# EAGLE design sd_tos_dip32 (EAGLE 6.2)
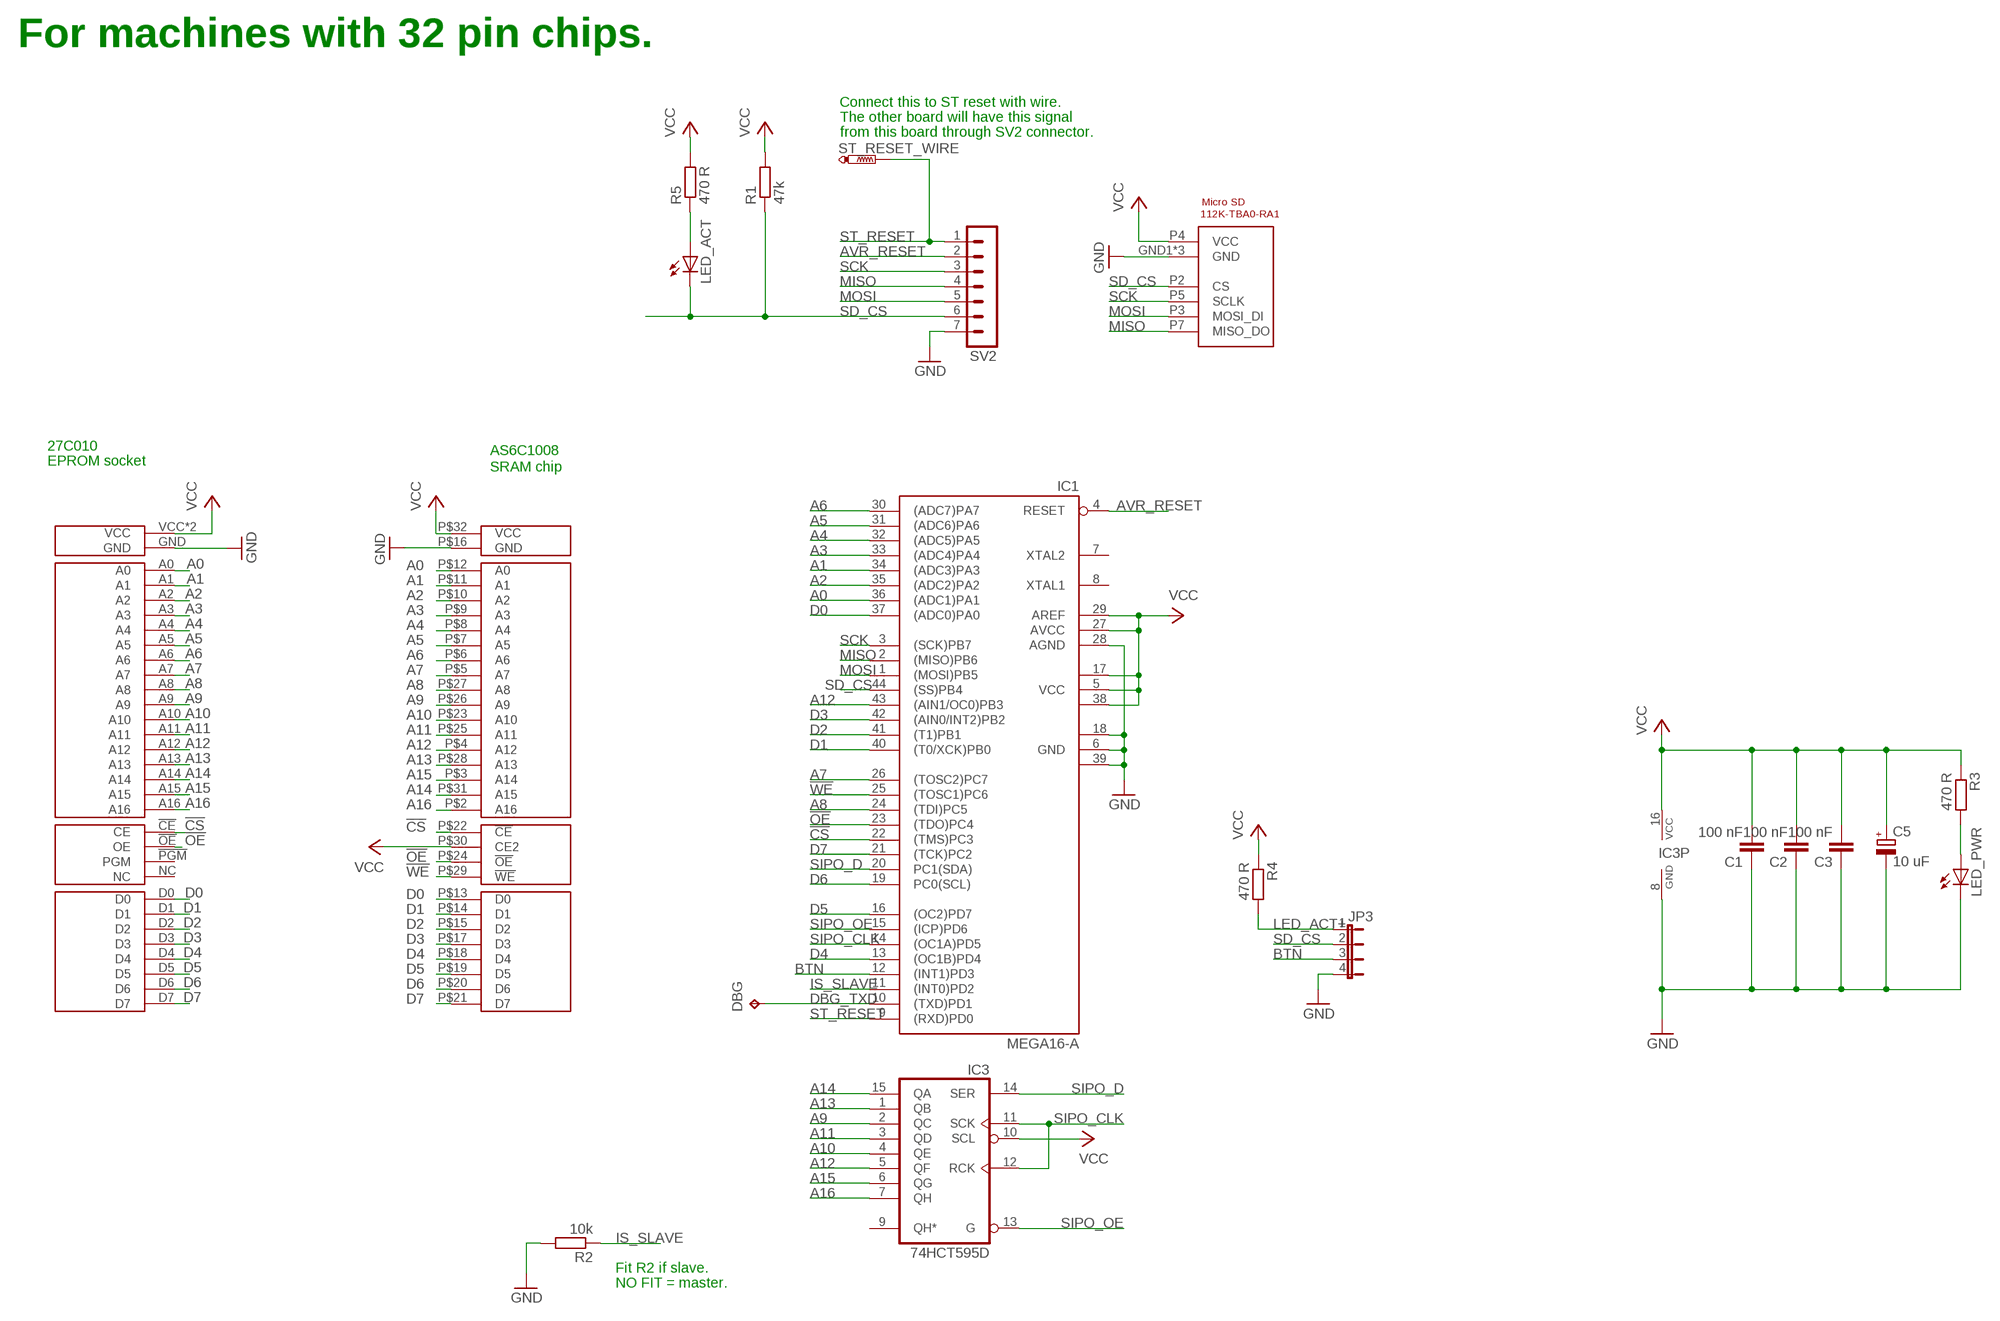
[diagram p0: schematic, sheet 1]

## Parts
C1  100 nF  C-EUC0603  [C0603]
C2  100 nF  C-EUC0603  [C0603]
C3  100 nF  C-EUC0603  [C0603]
C5  10 uF  CPOL-EUSANYO_SMD_B6  [SANYO-OSCON_SMD_B6]
DBG  TPB1,27  [B1,27]
IC1  MEGA16-A  [TQFP44]
IC3  74HCT595D  [SO16]
JP3  JP4E  [JP4]
LED_ACT  LEDCHIP-LED0805  [CHIP-LED0805]
LED_PWR  LEDCHIP-LED0805  [CHIP-LED0805]
R1  47k  R-EU_R0603  [R0603]
R2  10k  R-EU_R0603  [R0603]
R3  470 R  R-EU_R0603  [R0603]
R4  470 R  R-EU_R0603  [R0603]
R5  470 R  R-EU_R0603  [R0603]
ST_RESET_WIRE  PTR1PAD1-13  [P1-13]
SV2  MA07-1  [MA07-1]
U$1  27C010_BOTTOM_ONLY  [DIP32_BOTTOM_ONLY]
U$2  AS6C1008DIP32  [DIP32]
U$3  MICRO_SD  [MICRO_SD]

## Nets
!CS: IC1.22((TMS)PC3) U$1.!CE(CE) U$2.P$22(!CE)
!OE: IC1.23((TDO)PC4) U$1.!OE(OE) U$2.P$24(!OE)
!WE: IC1.25((TOSC1)PC6) U$2.P$29(!WE)
A0: IC1.36((ADC1)PA1) U$1.A0 U$2.P$12(A0)
A1: IC1.34((ADC3)PA3) U$1.A1 U$2.P$11(A1)
A2: IC1.35((ADC2)PA2) U$1.A2 U$2.P$10(A2)
A3: IC1.33((ADC4)PA4) U$1.A3 U$2.P$9(A3)
A4: IC1.32((ADC5)PA5) U$1.A4 U$2.P$8(A4)
A5: IC1.31((ADC6)PA6) U$1.A5 U$2.P$7(A5)
A6: IC1.30((ADC7)PA7) U$1.A6 U$2.P$6(A6)
A7: IC1.26((TOSC2)PC7) U$1.A7 U$2.P$5(A7)
A8: IC1.24((TDI)PC5) U$1.A8 U$2.P$27(A8)
A9: IC3.2(QC) U$1.A9 U$2.P$26(A9)
A10: IC3.4(QE) U$1.A10 U$2.P$23(A10)
A11: IC3.3(QD) U$1.A11 U$2.P$25(A11)
A12: IC1.43((AIN1/OC0)PB3) IC3.5(QF) U$1.A12 U$2.P$4(A12)
A13: IC3.1(QB) U$1.A13 U$2.P$28(A13)
A14: IC3.15(QA) U$1.A14 U$2.P$31(A15)
A15: IC3.6(QG) U$1.A15 U$2.P$3(A14)
A16: IC3.7(QH) U$1.A16 U$2.P$2(A16)
AVR_RESET: IC1.4(RESET) SV2.2
BTN: IC1.12((INT1)PD3) JP3.3
D0: IC1.37((ADC0)PA0) U$1.D0 U$2.P$13(D0)
D1: IC1.40((T0/XCK)PB0) U$1.D1 U$2.P$14(D1)
D2: IC1.41((T1)PB1) U$1.D2 U$2.P$15(D2)
D3: IC1.42((AIN0/INT2)PB2) U$1.D3 U$2.P$17(D3)
D4: IC1.13((OC1B)PD4) U$1.D4 U$2.P$18(D4)
D5: IC1.16((OC2)PD7) U$1.D5 U$2.P$19(D5)
D6: IC1.19(PC0(SCL)) U$1.D6 U$2.P$20(D6)
D7: IC1.21((TCK)PC2) U$1.D7 U$2.P$21(D7)
DBG_TXD: DBG.TP IC1.10((TXD)PD1)
GND: C1.1 C2.1 C3.1 C5.- IC1.6(GND) IC1.18(GND1) IC1.28(AGND) IC1.39(GND2) IC3.8(GND) JP3.4 LED_PWR.C R2.2 SV2.7 U$1.GND U$2.P$16(GND) U$3.GND1(GND) U$3.GND2(GND) U$3.P6(GND)
IS_SLAVE: IC1.11((INT0)PD2) R2.1
LED_ACT+: JP3.1 R4.2
MISO: IC1.2((MISO)PB6) SV2.4 U$3.P7(MISO_DO)
MOSI: IC1.1((MOSI)PB5) SV2.5 U$3.P3(MOSI_DI)
N$1: LED_PWR.A R3.2
N$2: LED_ACT.A R5.1
SCK: IC1.3((SCK)PB7) SV2.3 U$3.P5(SCLK)
SD_CS: IC1.44((SS)PB4) JP3.2 LED_ACT.C R1.1 SV2.6 U$3.P2(CS)
SIPO_CLK: IC1.14((OC1A)PD5) IC3.11(SCK) IC3.12(RCK)
SIPO_D: IC1.20(PC1(SDA)) IC3.14(SER)
SIPO_OE: IC1.15((ICP)PD6) IC3.13(G)
ST_RESET: IC1.9((RXD)PD0) ST_RESET_WIRE.TP SV2.1
VCC: C1.2 C2.2 C3.2 C5.+ IC1.5(VCC) IC1.17(VCC1) IC1.27(AVCC) IC1.29(AREF) IC1.38(VCC2) IC3.10(SCL) IC3.16(VCC) R1.2 R3.1 R4.1 R5.2 U$1.VCC U$1.VPP(VCC) U$2.P$30(CE2) U$2.P$32(VCC) U$3.P4(VCC)
Unconnected: IC1.7(XTAL2) IC1.8(XTAL1) IC3.9(QH*) U$1.!PGM(PGM) U$1.NC

## Notes on the sheet
- For machines with 32 pin chips.
- Connect this to ST reset with wire.
- The other board will have this signal
- from this board through SV2 connector.
- 27C010
- AS6C1008
- EPROM socket
- SRAM chip
- Fit R2 if slave.
- NO FIT = master.

## Library data of the parts
C1-C3 = rcl:C-EU: CAPACITOR, European symbol
C5 = rcl:CPOL-EU: POLARIZED CAPACITOR, European symbol
DBG = testpad:TP: Test pad
IC1 = avr-6:MEGA16: MICROCONTROLLER 16 Kbytes FLASH 1 kbytes SRAM 512 bytes EEPROM USART 8-channel 10 bit ADC
IC3 = 74xx-eu:74*595: 8-bit SHIFT REGISTER, output latch
JP3 = jumper:JP4E: JUMPER
LED_ACT LED_PWR = led:LED: LED OSRAM: - CHIPLED LG R971, LG N971, LY N971, LG Q971, LY Q971, LO R971, LY R971 LH N974, LH R974 LS Q976, LO Q976, LY Q976 LO Q996 - Hyper CHIPLED LW Q18S LB Q993, LB Q99A, LB R99A - SideLED LS A670, LO A670, LY A670, LG A670, LP A670 LB A673, LV A673, LT A673, LW A673 LH A674 LY A675 LS A676, LA A676, LO A676, LY A676, LW A676 LS A679, LY A679, LG A679 - Hyper Micro SIDELED® LS Y876, LA Y876, LO Y876, LY Y876 LT Y87S - SmartLED LW L88C, LW L88S LB L89C, LB L89S, LG L890 LS L89K, LO L89K, LY L89K LS L896, LA L896, LO L896, LY L896 - TOPLED LS T670, LO T670, LY T670, LG T670, LP T670 LSG T670, LSP T670, LSY T670, LOP T670, LYG T670 LG T671, LOG T671, LSG T671 LB T673, LV T673, LT T673, LW T673 LH T674 LS T676, LA T676, LO T676, LY T676, LB T676, LH T676, LSB T676, LW T676 LB T67C, LV T67C, LT T67C, LS T67K, LO T67K, LY T67K, LW E67C LS E67B, LA E67B, LO E67B, LY E67B, LB E67C, LV E67C, LT E67C LW T67C LS T679, LY T679, LG T679 LS T770, LO T770, LY T770, LG T770, LP T770 LB T773, LV T773, LT T773, LW T773 LH T774 LS E675, LA E675, LY E675, LS T675 LS T776, LA T776, LO T776, LY T776, LB T776 LHGB T686 LT T68C, LB T68C - Hyper Mini TOPLED® LB M676 - Mini TOPLED Santana® LG M470 LS M47K, LO M47K, LY M47K Source: http://www.osram.convergy.de LUXEON: - LUMILED® LXK2-PW12-R00, LXK2-PW12-S00, LXK2-PW14-U00, LXK2-PW14-V00 LXK2-PM12-R00, LXK2-PM12-S00, LXK2-PM14-U00 LXK2-PE12-Q00, LXK2-PE12-R00, LXK2-PE12-S00, LXK2-PE14-T00, LXK2-PE14-U00 LXK2-PB12-K00, LXK2-PB12-L00, LXK2-PB12-M00, LXK2-PB14-N00, LXK2-PB14-P00, LXK2-PB14-Q00 LXK2-PR12-L00, LXK2-PR12-M00, LXK2-PR14-Q00, LXK2-PR14-R00 LXK2-PD12-Q00, LXK2-PD12-R00, LXK2-PD12-S00 LXK2-PH12-R00, LXK2-PH12-S00 LXK2-PL12-P00, LXK2-PL12-Q00, LXK2-PL12-R00 Source: www.luxeon.com KINGBRIGHT: KA-3528ASYC Source: www.kingbright.com
R1-R5 = rcl:R-EU_: RESISTOR, European symbol
ST_RESET_WIRE = testpad:PTR1: TEST PIN
SV2 = con-lstb:MA07-1: PIN HEADER; OC_FARNELL: unknown; OC_NEWARK: unknown
U$1 = sd_tos:27C010_BOTTOM_ONLY
U$2 = sd_tos:AS6C1008
U$3 = sd_tos:MICRO_SD

## Board
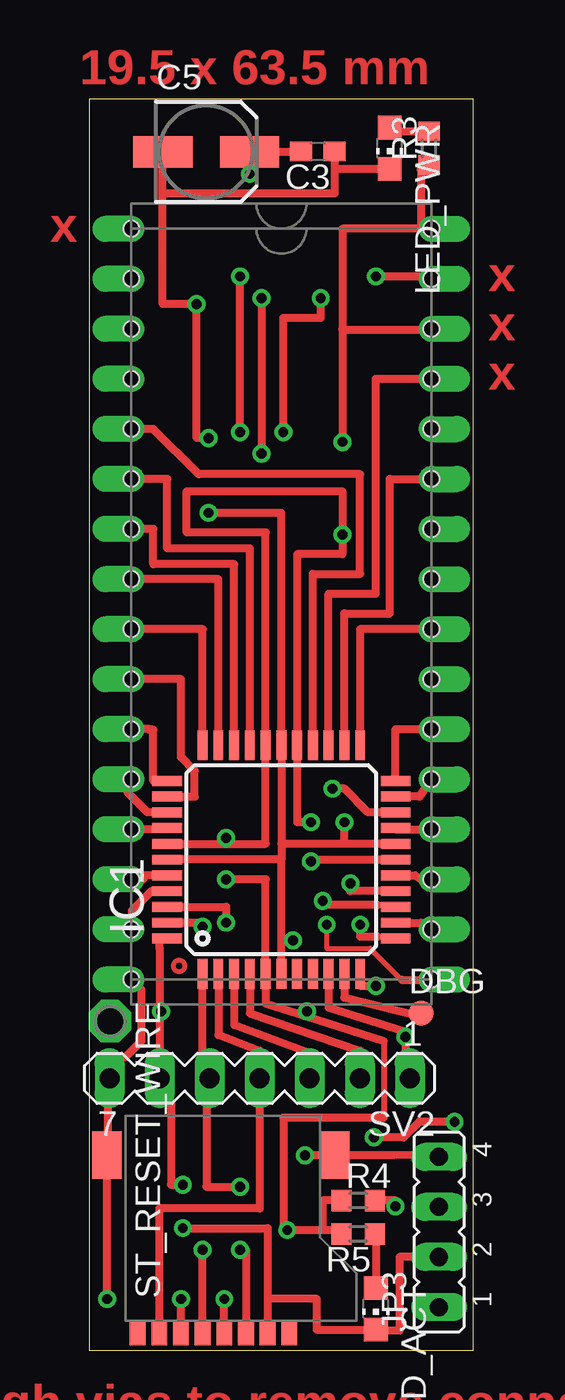
[diagram p1: board, top side]
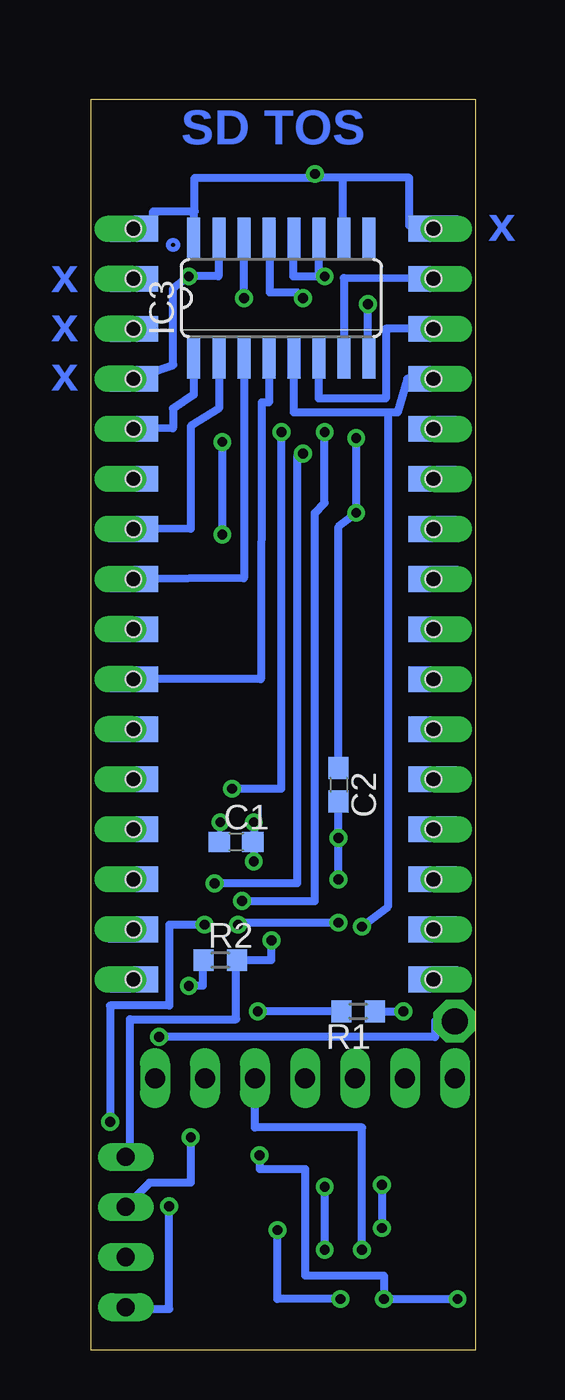
[diagram p2: board, bottom side, seen from below]

Size 19.5 x 63.5 mm. Coordinates in mm from the lower left corner, seen from the top.
Outline: 0,0 19.5,0 19.5,63.5 0,63.5 0,0
Copper layers (1*16): Top 0.035mm / dielectric 1.5mm / Bottom 0.035mm
Design rules: minimum track width 0.2mm, minimum drill 0.5mil, track to track 0.2mm, track to pad 0.2mm, pad to pad 0.2mm, via to via 0.2mm, smd to smd 0mil, copper to edge 0.1mm, drill to drill 0.1mm, minimum pad ring 10mil, minimum via ring 8mil, stop-mask expansion 4mil, vias tented up to drill 0mil, thermal gap 10mil

### Footprints (pad centres in the part's own frame; a part is rotated, then mirrored left to right if it is on the bottom)
C0603 = smd 1.1 x 1: 1 -0.85,0; 2 0.85,0
SANYO-OSCON_SMD_B6 = smd 3 x 1.6: + 2.2,0; - -2.2,0
B1,27 = smd 1.27 x 1.27: TP 0,0
TQFP44 = smd 1.5 x 0.5: 1 -5.8,4; 2 -5.8,3.2; 3 -5.8,2.4; 4 -5.8,1.6; 5 -5.8,0.8; 6 -5.8,0; 7 -5.8,-0.8; 8 -5.8,-1.6; 9 -5.8,-2.4; 10 -5.8,-3.2; 11 -5.8,-4; 23 5.8,-4; 24 5.8,-3.2; 25 5.8,-2.4; 26 5.8,-1.6; 27 5.8,-0.8; 28 5.8,0; 29 5.8,0.8; 30 5.8,1.6; 31 5.8,2.4; 32 5.8,3.2; 33 5.8,4 | smd 0.5 x 1.5: 12 -4,-5.8; 13 -3.2,-5.8; 14 -2.4,-5.8; 15 -1.6,-5.8; 16 -0.8,-5.8; 17 0,-5.8; 18 0.8,-5.8; 19 1.6,-5.8; 20 2.4,-5.8; 21 3.2,-5.8; 22 4,-5.8; 34 4,5.8; 35 3.2,5.8; 36 2.4,5.8; 37 1.6,5.8; 38 0.8,5.8; 39 0,5.8; 40 -0.8,5.8; 41 -1.6,5.8; 42 -2.4,5.8; 43 -3.2,5.8; 44 -4,5.8
SO16 = smd 0.66 x 2.032: 1 -4.445,-3.073; 2 -3.175,-3.073; 3 -1.905,-3.073; 4 -0.635,-3.073; 5 0.635,-3.073; 6 1.905,-3.073; 7 3.175,-3.073; 8 4.445,-3.073; 9 4.445,3.073; 10 3.175,3.073; 11 1.905,3.073; 12 0.635,3.073; 13 -0.635,3.073; 14 -1.905,3.073; 15 -3.175,3.073; 16 -4.445,3.073
JP4 = drill 0.914 long: 1 -3.81,0; 2 -1.27,0; 3 1.27,0; 4 3.81,0
CHIP-LED0805 = smd 1.2 x 1.2: A 0,-1.05; C 0,1.05
R0603 = smd 1 x 1.1: 1 -0.85,0; 2 0.85,0
P1-13 = drill 1.321 pad 2.159 octagon: TP 0,0
MA07-1 = drill 1.016 long: 1 -7.62,0; 2 -5.08,0; 3 -2.54,0; 4 0,0; 5 2.54,0; 6 5.08,0; 7 7.62,0
DIP32_BOTTOM_ONLY = smd 2.54 x 1.3 bottom: !CE 7.62,-5.08; !OE 7.62,0; !PGM 7.62,17.78; A0 -7.62,-7.62; A1 -7.62,-5.08; A2 -7.62,-2.54; A3 -7.62,0; A4 -7.62,2.54; A5 -7.62,5.08; A6 -7.62,7.62; A7 -7.62,10.16; A8 7.62,7.62; A9 7.62,5.08; A10 7.62,-2.54; A11 7.62,2.54; A12 -7.62,12.7; A13 7.62,10.16; A14 7.62,12.7; A15 -7.62,15.24; A16 -7.62,17.78; D0 -7.62,-10.16; D1 -7.62,-12.7; D2 -7.62,-15.24; D3 7.62,-17.78; D4 7.62,-15.24; D5 7.62,-12.7; D6 7.62,-10.16; D7 7.62,-7.62; GND -7.62,-17.78; NC 7.62,15.24; VCC 7.62,20.32; VPP -7.62,20.32 | hole 0.8: -7.62,20.32; -7.62,17.78; -7.62,15.24; -7.62,12.7; -7.62,10.16; -7.62,7.62; -7.62,5.08; -7.62,2.54; -7.62,0; -7.62,-2.54; -7.62,-5.08; -7.62,-7.62; -7.62,-10.16; -7.62,-12.7; -7.62,-15.24; -7.62,-17.78; 7.62,-17.78; 7.62,-15.24; 7.62,-12.7; 7.62,-10.16; 7.62,-7.62; 7.62,-5.08; 7.62,-2.54; 7.62,0; 7.62,2.54; 7.62,5.08; 7.62,7.62; 7.62,10.16; 7.62,12.7; 7.62,15.24; 7.62,17.78; 7.62,20.32
DIP32 = drill 0.8 pad 1.27 offset: P$1 -7.62,20.32; P$2 -7.62,17.78; P$3 -7.62,15.24; P$4 -7.62,12.7; P$5 -7.62,10.16; P$6 -7.62,7.62; P$7 -7.62,5.08; P$8 -7.62,2.54; P$9 -7.62,0; P$10 -7.62,-2.54; P$11 -7.62,-5.08; P$12 -7.62,-7.62; P$13 -7.62,-10.16; P$14 -7.62,-12.7; P$15 -7.62,-15.24; P$16 -7.62,-17.78; P$17 7.62,-17.78; P$18 7.62,-15.24; P$19 7.62,-12.7; P$20 7.62,-10.16; P$21 7.62,-7.62; P$22 7.62,-5.08; P$23 7.62,-2.54; P$24 7.62,0; P$25 7.62,2.54; P$26 7.62,5.08; P$27 7.62,7.62; P$28 7.62,10.16; P$29 7.62,12.7; P$30 7.62,15.24; P$31 7.62,17.78; P$32 7.62,20.32
MICRO_SD = smd 1.5 x 2.4: GND1 -5.952,9; GND2 5.617,9 | smd 0.8 x 1.3: P1 3.3,0; P2 2.2,0; P3 1.1,0; P4 0,0; P5 -1.1,0; P6 -2.2,0; P7 -3.3,0; P8 -4.4,0

### Placement (x,y rotation side)
C1  12.15,25.8 0 bottom
C2  6.95,28.7 270 bottom
C3  11.6,60.84 180 top
C5  5.93,60.82 0 top
DBG  16.85,17.1 0 top
IC1  9.75,24.9 90 top
IC3  9.85,53.4 0 bottom
JP3  17.75,6 90 top
LED_ACT  14.55,2.1 180 top
LED_PWR  15.25,61 180 top
R1  5.95,17.2 180 bottom
R2  12.95,19.8 0 bottom
R3  17.25,61 90 top
R4  13.65,7.6 0 top
R5  13.65,5.9 180 top
ST_RESET_WIRE  1.05,16.7 270 top
SV2  8.65,13.8 180 top
U$1  9.75,36.6 0 top
U$2  9.75,36.6 0 top
U$3  6.85,0.9 0 top

### Tracks (layer width: path | path; a pad name or v marks a point on that pad's centre or on a via)
!CS
  Top 0.406: IC1.22 15.55,31.52 U$2.P$22
!OE
  Top 0.406: U$2.P$24 13.75,36.6 IC1.23
!WE
  Top 0.406: IC1.25 12.15,38.4 14.55,38.4 14.55,49.3 U$2.P$29
A0
  Top 0.406: IC1.36 2.95,27.3 1.95,28.3 1.95,28.8 U$2.P$12
  Bottom 0.25: 2.08,29.08 U$2.P$12
A1
  Top 0.25: 3.05,31.5 3.05,31.52
  Top 0.406: IC1.34 3.25,28.9 3.25,31.5 3.05,31.5 | 3.05,31.52 U$2.P$11
  Bottom 0.25: 2.08,31.62 U$2.P$11
A2
  Top 0.406: IC1.35 5.35,28.1 5.35,29.4 4.65,30.1 4.65,34.06 U$2.P$10
A3
  Top 0.406: IC1.33 5.75,36.6 U$2.P$9
A4
  Top 0.406: IC1.32 6.55,39.14 U$2.P$8
A5
  Top 0.406: IC1.31 7.35,39.9 3.25,39.9 3.25,41.68 U$2.P$7
  Bottom 0.25: 2.08,41.78 U$2.P$7
A6
  Top 0.406: IC1.30 8.15,40.7 3.95,40.7 3.95,44.22 U$2.P$6
  Bottom 0.25: 2.08,44.32 U$2.P$6
A7
  Top 0.406: IC1.26 11.35,39.4 13.75,39.4 13.75,44.46 5.55,44.46 3.25,46.76 U$2.P$5
  Bottom 0.25: 2.08,46.86 U$2.P$5
A8
  Top 0.406: IC1.24 12.95,37.4 15.25,37.4 15.25,44.22 U$2.P$27
  Bottom 0.25: 17.32,44.32 U$2.P$27
A9
  Bottom 0.406: IC3.2 13.02,47.8 14.45,46.9 14.45,41.7 U$2.P$26
A10
  Bottom 0.406: IC3.4 10.48,48.1 10.85,48.1 10.88,34.06 U$2.P$23
A11
  Bottom 0.406: IC3.3 11.76,39.18 U$2.P$25
A12  (via drill 0.5 pad 0.8)
  Top 0.406: v5.75,21.5 5.75,21.7 IC1.43
  Bottom 0.406: U$2.P$4 3.45,49.3 3.95,47.6 4.45,47.6 | 4.45,47.6 9.22,47.6 IC3.5 | 4.45,47.6 4.45,22.5 v5.75,21.5
A13
  Bottom 0.25: 17.32,46.86 U$2.P$28
  Bottom 0.406: IC3.1 14.3,48.5 15.35,47.8 15.35,46.8 U$2.P$28
A14  (via drill 0.5 pad 0.8)
  Top 0.25: 17.37,54.5 U$2.P$31
  Top 0.406: v14.55,54.5 17.37,54.5
  Bottom 0.406: IC3.15 13.05,56.47 13.05,54.5 v14.55,54.5 15.34,53.9 15.34,50 U$1.A14
A15
  Bottom 0.406: U$2.P$3 4.55,51.84 4.55,48.3 7.95,48.3 IC3.6
A16
  Bottom 0.406: U$2.P$2 6.67,54.42 IC3.7
AVR_RESET
  Top 0.25: 13.75,15.2 SV2.2
  Top 0.406: IC1.4 8.15,17.1 13.75,15.2
BTN  (via drill 0.5 pad 0.8)
  Top 0.25: 15.85,20.8 15.55,20.8 IC1.12 15.15,20.9 14.65,21 | 15.85,20.8 15.85,20.9 16.05,20.9 | 15.85,20.8 16.15,20.8
  Top 0.406: v18.55,11.6 16.75,11.6 15.95,10.8 v14.45,10.8 | v13.75,21.6 13.75,21 14.65,21
  Bottom 0.406: v18.55,11.6 18.55,17.5 15.55,17.5 15.55,21.6 v13.75,21.6 | v14.45,10.8 14.45,8.5 16.55,8.5 JP3.3
D0
  Top 0.25: IC1.37 3.95,26.44
  Top 0.406: 3.95,26.44 U$2.P$13
D1
  Top 0.406: IC1.40 2.75,24.1 2.75,23.9 U$2.P$14
D2
  Top 0.25: 2.15,21.38 U$2.P$15
  Top 0.406: IC1.41 3.15,23.3 2.15,22.3 2.15,21.38
  Bottom 0.25: 2.08,21.46 U$2.P$15
D3  (via drill 0.5 pad 0.8)
  Top 0.25: v12.05,21.6 12.05,20.4 14.25,20.4 15.85,18.8 | 17.35,18.8 U$2.P$17
  Top 0.406: IC1.42 6.95,22.5 v6.95,21.7 | 15.85,18.8 17.35,18.8
  Bottom 0.25: 12.05,21.7 v12.05,21.6
  Bottom 0.406: v6.95,21.7 12.05,21.7
D4
  Top 0.406: IC1.13 16.85,21.7 17.25,21.36 U$2.P$18
  Bottom 0.25: 17.32,21.46 U$2.P$18
D5
  Top 0.406: IC1.16 16.55,24.1 16.85,23.9 U$2.P$19
D6
  Top 0.25: IC1.19 15.55,26.44
  Top 0.406: 15.55,26.44 U$2.P$20
  Bottom 0.25: 17.32,26.54 U$2.P$20
D7
  Top 0.406: U$2.P$21 16.77,28.1 IC1.21
  Bottom 0.25: 17.32,29.08 U$2.P$21
DBG_TXD
  Top 0.25: 16.65,17 16.65,17.1 DBG.TP
  Top 0.406: IC1.10 12.95,17.9 16.65,17
GND  (via drill 0.5 pad 0.8)
  Top 0.25: SV2.7 0.95,13.8 | JP3.4 17.75,9.91 | IC1.18 12.95,25.7
  Top 0.406: 0.95,13.8 U$3.GND1 v0.9,2.6 | U$3.P6 v4.65,2.6 | v10.95,9.9 U$3.GND2 15.45,9.9 17.75,9.91 | 9.75,25.7 IC1.28 9.75,42.5 v6.05,42.5 | 9.75,25.7 9.75,24.9 | 9.75,24.9 IC1.39 | IC1.18 9.75,25.7 | IC1.6 9.75,20.8 | 9.75,20.8 9.75,24.9 | C3.1 12.45,59.95 | 12.45,59.95 12.45,58.7 3.73,58.7 | 3.73,58.7 C5.- | 3.73,58.7 3.73,53.1 v5.45,53.1 5.45,46.3 v6.05,46.3 | v10.35,20.8 9.75,20.8 | SV2.7 1.03,14.48 1.45,14.9 1.85,14.9 2.65,15.7 2.65,18.3 U$2.P$16 | 12.95,25.7 v12.95,26.8 | LED_PWR.C 12.45,59.95
  Bottom 0.25: IC3.8 5.45,50.33 | v12.95,26.8 13,26.8 C1.1
  Bottom 0.406: v0.9,2.6 v4.65,2.6 4.65,3.8 8.65,3.8 8.65,9.2 10.95,9.2 v10.95,9.9 | JP3.4 17.55,9.81 17.55,16.8 12.15,16.8 12.15,19.8 R2.2 10.35,19.8 v10.35,20.8 | 5.45,50.33 v5.45,53.1 | v6.05,46.3 v6.05,42.5 6.95,41.8 C2.1
IS_SLAVE  (via drill 0.5 pad 0.8)
  Top 0.25: IC1.11 13.75,18.5
  Top 0.406: 13.75,18.5 v14.55,18.5
  Bottom 0.25: R2.1 13.85,19.8
  Bottom 0.406: 13.85,19.8 13.85,18.5 v14.55,18.5
LED_ACT+  (via drill 0.5 pad 0.8)
  Top 0.406: v15.55,7.3 15.55,7.6 R4.2
  Bottom 0.25: JP3.1 17.45,2.1
  Bottom 0.406: 17.45,2.1 15.55,2.1 v15.55,7.3
MISO
  Top 0.25: 8.65,13.4 SV2.4 8.65,15.2
  Top 0.406: IC1.2 6.55,16 8.65,15.2 | 8.65,13.4 8.65,7.2 3.55,7.2 U$3.P7
MOSI  (via drill 0.5 pad 0.8)
  Top 0.25: 5.75,13.8 5.95,13.8 SV2.5
  Top 0.406: 5.75,13.8 IC1.1 | 5.95,13.8 5.95,8.3 v7.65,8.3 | v7.65,5.1 7.95,5.1 U$3.P3
  Bottom 0.406: v7.65,8.3 v7.65,5.1
N$1
  Top 0.25: 15.25,61.85 LED_PWR.A
  Top 0.406: R3.2 15.25,61.85
N$2
  Top 0.406: R5.1 14.55,5.9 LED_ACT.A
SCK  (via drill 0.5 pad 0.8)
  Top 0.25: 11.15,15.1 SV2.3
  Top 0.406: IC1.3 7.35,16.5 11.15,15.1 | U$3.P5 v5.75,5.1
  Bottom 0.406: v5.75,5.1 5.75,11.3 11.19,11.3 SV2.3
SD_CS  (via drill 0.5 pad 0.8)
  Top 0.25: IC1.44 3.55,20.9 | 3.55,20.4 3.57,20.4 | SV2.6 3.55,13.8 | v3.65,17.2 3.57,17.2 | 15.05,1 LED_ACT.C
  Top 0.406: 3.55,20.9 3.55,20.4 | 3.57,20.4 3.57,17.2 SV2.6 | 3.55,13.8 4.15,12.6 4.15,8.4 v4.75,8.4 | v4.75,6.2 9.05,6.2 9.05,2.6 | 9.05,2.6 U$3.P2 | 9.05,2.6 11.55,2.6 11.55,1.05 LED_ACT.C | JP3.2 15.75,4.73 15.75,1 15.05,1
  Bottom 0.406: v4.75,8.4 v4.75,6.2 | R1.1 v3.65,17.2
SIPO_CLK  (via drill 0.5, 0.5 pad 0.8)
  Top 0.25: IC1.14 14.65,22.6 | 11.85,22.6 v11.85,22.8
  Top 0.406: v7.65,46.6 v7.65,54.5 | 14.65,22.6 11.85,22.6
  Bottom 0.25: v7.65,54.5 7.95,54.5 | IC3.12 9.25,56.47
  Bottom 0.406: v7.65,46.6 7.65,43 8.15,42.5 8.15,22.8 v11.85,22.8 | 7.95,54.5 IC3.11 | 9.25,56.47 9.25,54.5 v7.65,54.5
SIPO_D  (via drill 0.5 pad 0.8)
  Top 0.406: IC1.20 14.15,27.3 12.95,28.5 v12.35,28.5 | v9.85,46.6 9.85,52.4 11.75,52.4 v11.75,53.4
  Bottom 0.406: v12.35,28.5 9.85,28.5 v9.85,46.6 | v11.75,53.4 11.76,55.1 IC3.14
SIPO_OE  (via drill 0.5 pad 0.8)
  Top 0.406: v8.75,53.4 v8.75,45.5 | IC1.15 13.25,23.3 v13.25,23.7
  Bottom 0.25: IC3.13 10.45,56.47
  Bottom 0.406: 10.45,56.47 10.45,53.7 9.05,53.7 v8.75,53.4 | v8.75,45.5 8.75,45.4 9.05,45.4 9.05,23.7 v13.25,23.7
ST_RESET  (via drill 0.5 pad 0.8)
  Top 0.406: SV2.1 16.05,14 v16.05,15.9 15.95,16.2 12.15,17.4 IC1.9
  Bottom 0.406: ST_RESET_WIRE.TP 2.05,16.7 2.05,15.9 v16.05,15.9
VCC  (via drill 0.5 pad 0.8)
  Top 0.25: U$2.P$32 16.83,56.92 | 17.37,51.8 U$2.P$30 | 12.35,6.1 R5.2 | v11.25,24.8 11.25,24.9 | 10.75,60.82 C3.2 | v8.15,59.7 8.13,59.7 C5.+ | v11.05,17.2 10.88,17.2 10.98,16.96 | R3.1 17.25,59.9 16.83,59.9
  Top 0.305: 14.95,15.7 14.95,11.8
  Top 0.406: 12.85,51.8 12.85,56.92 16.83,56.92 16.83,59.9 | 12.85,51.8 17.37,51.8 | U$3.P4 v6.85,2.6 | 11.85,6.1 v10.05,6.1 9.85,6.1 9.85,11.8 14.95,11.8 | 11.85,6.1 12.35,6.1 | IC1.38 6.95,25.7 | 6.95,25.7 8.95,25.7 IC1.29 8.95,41.5 4.95,41.5 4.95,43.6 12.85,43.6 v12.85,41.4 12.85,40.4 10.55,40.4 IC1.27 10.55,26.8 v11.25,26.8 | v6.95,23.9 8.95,23.9 IC1.5 8.95,17.6 10.98,16.96 14.95,15.7 | v6.95,26 6.95,25.7 | 11.25,24.9 IC1.17 | C5.+ 10.75,60.82 | 12.85,51.8 v12.85,46.1 | R4.1 11.85,7.6 11.85,6.1
  Bottom 0.25: 2.08,57 2.25,57 | 2.25,57 2.55,57 2.55,57.1 3.35,57.1 | 6.75,56.47 IC3.10 | 14.3,57.8 14.25,57.8 | 8.15,59.5 v8.15,59.7 | C1.2 11.25,25.9 | 11.15,17.2 v11.05,17.2 | U$1.VPP 2.25,56.92 2.25,57
  Bottom 0.406: U$2.P$32 16.35,56.96 16.35,57.8 14.3,57.8 IC3.16 | 3.35,57.1 3.35,59.5 6.75,59.5 | 6.75,59.5 6.75,56.47 | v6.85,2.6 10.05,2.6 v10.05,6.1 | v6.95,23.9 v6.95,26 C2.2 | v11.25,26.8 11.25,25.9 v11.25,24.8 | 6.75,59.5 8.15,59.5 14.25,59.5 14.25,57.8 | v12.85,46.1 v12.85,41.4 | R1.2 v11.05,17.2
(copper drawn outside any net)
  shapes: Bottom circle x1, Top circle x1

### Text on the board
Top: For machines with 32 pin chips. | 19.5 x 63.5 mm | x | x | x | x | x - drill through vias to remove connection | between top and bottom layer
Bottom: SD TOS | x | x | x | x